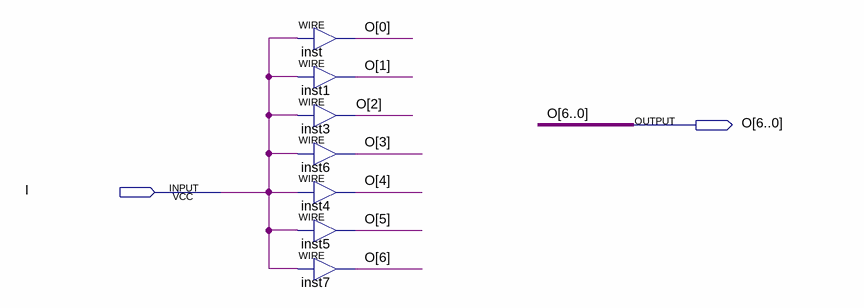
[diagram p0: schematic sheet]
// Quartus schematic Extend7.bdf as structural Verilog: 7 symbols, 2 pins
module Extend7 (
  input  I,
  output [6:0] O
);

  assign O[0] = I;  // WIRE inst
  assign O[1] = I;  // WIRE inst1
  assign O[2] = I;  // WIRE inst3
  assign O[3] = I;  // WIRE inst6
  assign O[4] = I;  // WIRE inst4
  assign O[5] = I;  // WIRE inst5
  assign O[6] = I;  // WIRE inst7
endmodule
